# EAGLE design Schematic (EAGLE 9.5.0)
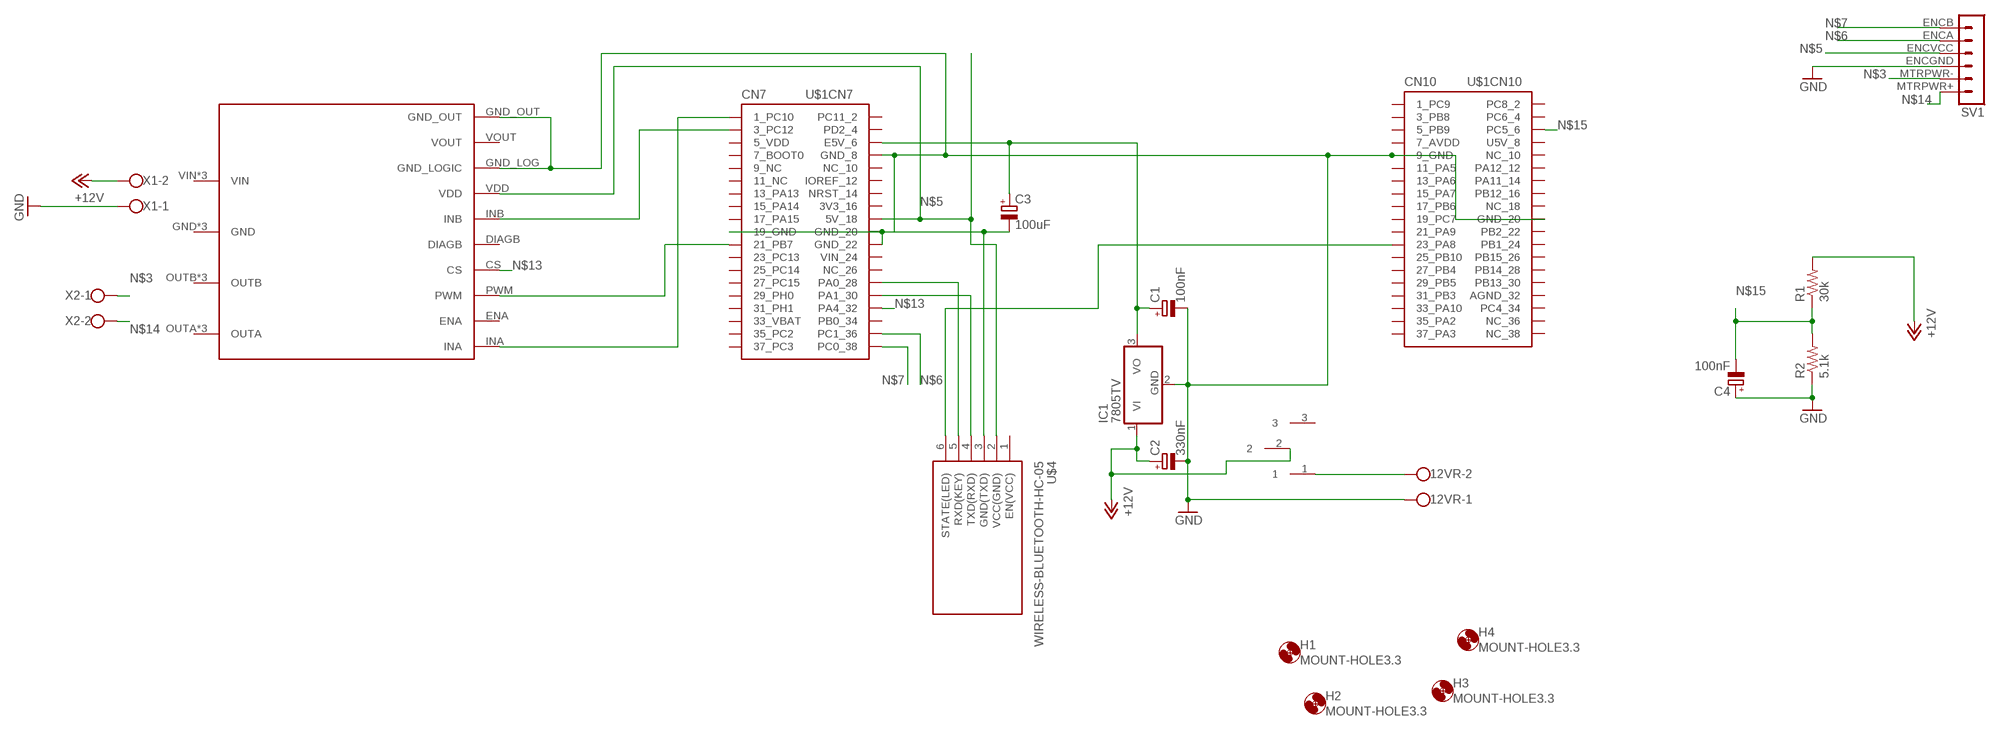
[diagram p0: schematic, sheet 1]

## Parts
12VR  W237-102  [W237-102]
C1  100nF  CPOL-EUE2.5-5  [E2,5-5]
C2  330nF  CPOL-EUE2.5-5  [E2,5-5]
C3  100uF  CPOL-EUE2.5-5  [E2,5-5]
C4  100nF  CPOL-EUE2.5-5  [E2,5-5]
H1  MOUNT-HOLE3.3  [3,3]
H2  MOUNT-HOLE3.3  [3,3]
H3  MOUNT-HOLE3.3  [3,3]
H4  MOUNT-HOLE3.3  [3,3]
IC1  7805TV  [TO220V]
R1  30k  R-US_0204/7  [0204/7]
R2  5.1k  R-US_0204/7  [0204/7]
SV1  MA06-1  [MA06-1]
U$1  NUCLEO-SHIELD-20PIN  [NUCLEO-SHIELD-UNDERSIDE-SHORT-20-PINHEADER]
U$2  VNH5019REAL  [MULTIPOWERSO-302]
U$3  TOGGLESWITCH  [TOGGLESWITCH]
U$4  WIRELESS-BLUETOOTH-HC-05  [WIRELESS-BLUETOOTH-HC-05]
X1  W237-102  [W237-102]
X2  W237-102  [W237-102]

## Nets
+12V: C2.+ IC1.1(VI) R1.2 U$3.2 X1.2
GND: 12VR.1 C1.- C2.- C3.- C4.+ IC1.2(GND) R2.1 SV1.ENCGND U$1.CN7_8(CN7:GND_8) U$1.CN7_19(CN7:19_GND) U$1.CN7_20(CN7:GND_20) U$1.CN7_22(CN7:GND_22) U$1.CN10_9(CN10:9_GND) U$1.CN10_20(CN10:GND_20) U$2.GND_LOG(GND_LOGIC) U$2.GND_OUT U$4.3(GND(TXD)) X1.1
N$1: U$1.CN7_1(CN7:1_PC10) U$2.INA
N$2: U$1.CN7_21(CN7:21_PB7) U$2.PWM
N$3: SV1.MTRPWR- X2.1
N$4: U$1.CN7_3(CN7:3_PC12) U$2.INB
N$5: SV1.ENCVCC U$1.CN7_18(CN7:5V_18) U$2.VDD U$4.2(VCC(GND))
N$6: SV1.ENCA U$1.CN7_36(CN7:PC1_36)
N$7: SV1.ENCB U$1.CN7_38(CN7:PC0_38)
N$8: 12VR.2 U$3.1
N$9: U$1.CN7_30(CN7:PA1_30) U$4.4(TXD(RXD))
N$10: C1.+ C3.+ IC1.3(VO) U$1.CN7_6(CN7:E5V_6)
N$11: U$1.CN7_28(CN7:PA0_28) U$4.5(RXD(KEY))
N$12: U$1.CN10_23(CN10:23_PA8) U$4.6(STATE(LED))
N$13: U$1.CN7_32(CN7:PA4_32) U$2.CS
N$14: SV1.MTRPWR+(MTRPWR) X2.2
N$15: C4.- R1.1 R2.2 U$1.CN10_6(CN10:PC5_6)
Unconnected: U$1.CN7_2(CN7:PC11_2) U$1.CN7_4(CN7:PD2_4) U$1.CN7_5(CN7:5_VDD) U$1.CN7_7(CN7:7_BOOT0) U$1.CN7_9(CN7:9_NC) U$1.CN7_10(CN7:NC_10) U$1.CN7_11(CN7:11_NC) U$1.CN7_12(CN7:IOREF_12) U$1.CN7_13(CN7:13_PA13) U$1.CN7_14(CN7:NRST_14) U$1.CN7_15(CN7:15_PA14) U$1.CN7_16(CN7:3V3_16) U$1.CN7_17(CN7:17_PA15) U$1.CN7_23(CN7:23_PC13) U$1.CN7_24(CN7:VIN_24) U$1.CN7_25(CN7:25_PC14) U$1.CN7_26(CN7:NC_26) U$1.CN7_27(CN7:27_PC15) U$1.CN7_29(CN7:29_PH0) U$1.CN7_31(CN7:31_PH1) U$1.CN7_33(CN7:33_VBAT) U$1.CN7_34(CN7:PB0_34) U$1.CN7_35(CN7:35_PC2) U$1.CN7_37(CN7:37_PC3) U$1.CN10_1(CN10:1_PC9) U$1.CN10_2(CN10:PC8_2) U$1.CN10_3(CN10:3_PB8) U$1.CN10_4(CN10:PC6_4) U$1.CN10_5(CN10:5_PB9) U$1.CN10_7(CN10:7_AVDD) U$1.CN10_8(CN10:U5V_8) U$1.CN10_10(CN10:NC_10) U$1.CN10_11(CN10:11_PA5) U$1.CN10_12(CN10:PA12_12) U$1.CN10_13(CN10:13_PA6) U$1.CN10_14(CN10:PA11_14) U$1.CN10_15(CN10:15_PA7) U$1.CN10_16(CN10:PB12_16) U$1.CN10_17(CN10:17_PB6) U$1.CN10_18(CN10:NC_18) U$1.CN10_19(CN10:19_PC7) U$1.CN10_21(CN10:21_PA9) U$1.CN10_22(CN10:PB2_22) U$1.CN10_24(CN10:PB1_24) U$1.CN10_25(CN10:25_PB10) U$1.CN10_26(CN10:PB15_26) U$1.CN10_27(CN10:27_PB4) U$1.CN10_28(CN10:PB14_28) U$1.CN10_29(CN10:29_PB5) U$1.CN10_30(CN10:PB13_30) U$1.CN10_31(CN10:31_PB3) U$1.CN10_32(CN10:AGND_32) U$1.CN10_33(CN10:33_PA10) U$1.CN10_34(CN10:PC4_34) U$1.CN10_35(CN10:35_PA2) U$1.CN10_36(CN10:NC_36) U$1.CN10_37(CN10:37_PA3) U$1.CN10_38(CN10:NC_38) U$2.DIAGB U$2.ENA U$2.GND U$2.GNDS1(GND) U$2.GNDS2(GND) U$2.OUTA U$2.OUTAS1(OUTA) U$2.OUTAS2(OUTA) U$2.OUTB U$2.OUTBS1(OUTB) U$2.OUTBS2(OUTB) U$2.VIN U$2.VINS1(VIN) U$2.VINS2(VIN) U$2.VOUT U$3.3

## Power pins joined to a net without a drawn wire
EN(VCC): U$4.1(EN(VCC))

## Library data of the parts
12VR X1 X2 = con-wago-500:W237-102: WAGO SCREW CLAMP; MPN: 237-102; OC_FARNELL: unknown; OC_NEWARK: 70K9898
C1-C4 = rcl:CPOL-EU: POLARIZED CAPACITOR, European symbol; SPICEPREFIX: C
H1-H4 = holes:MOUNT-HOLE: MOUNTING HOLE with drill center marker
IC1 = linear:78*: Positive VOLTAGE REGULATOR Source: http://cache.national.com/ds/LM/LM78L05.pdf http://www.fairchildsemi.com/ds/LM/LM7805.pdf
R1 R2 = rcl:R-US_: RESISTOR, American symbol; SPICEPREFIX: R
SV1 = Custom:MA06-1: PIN HEADER; OC_FARNELL: unknown; OC_NEWARK: unknown
U$1 = CN7Fixed:NUCLEO-SHIELD: Shield template for ST Nucleo boards
U$2 = Custom:VNH5019REAL
U$3 = Custom:TOGGLESWITCH
U$4 = BT_6pin:WIRELESS-BLUETOOTH-HC-05: Bluetooth Transceiver Module based on HC-05 board Tutorial is available here: https://arduino-info.wikispaces.com/BlueTooth-HC05-HC06-Modules-How-To Click here to find device on ebay.com <http://www.ebay.com/sch/hc-05+module+rs232>

## Board
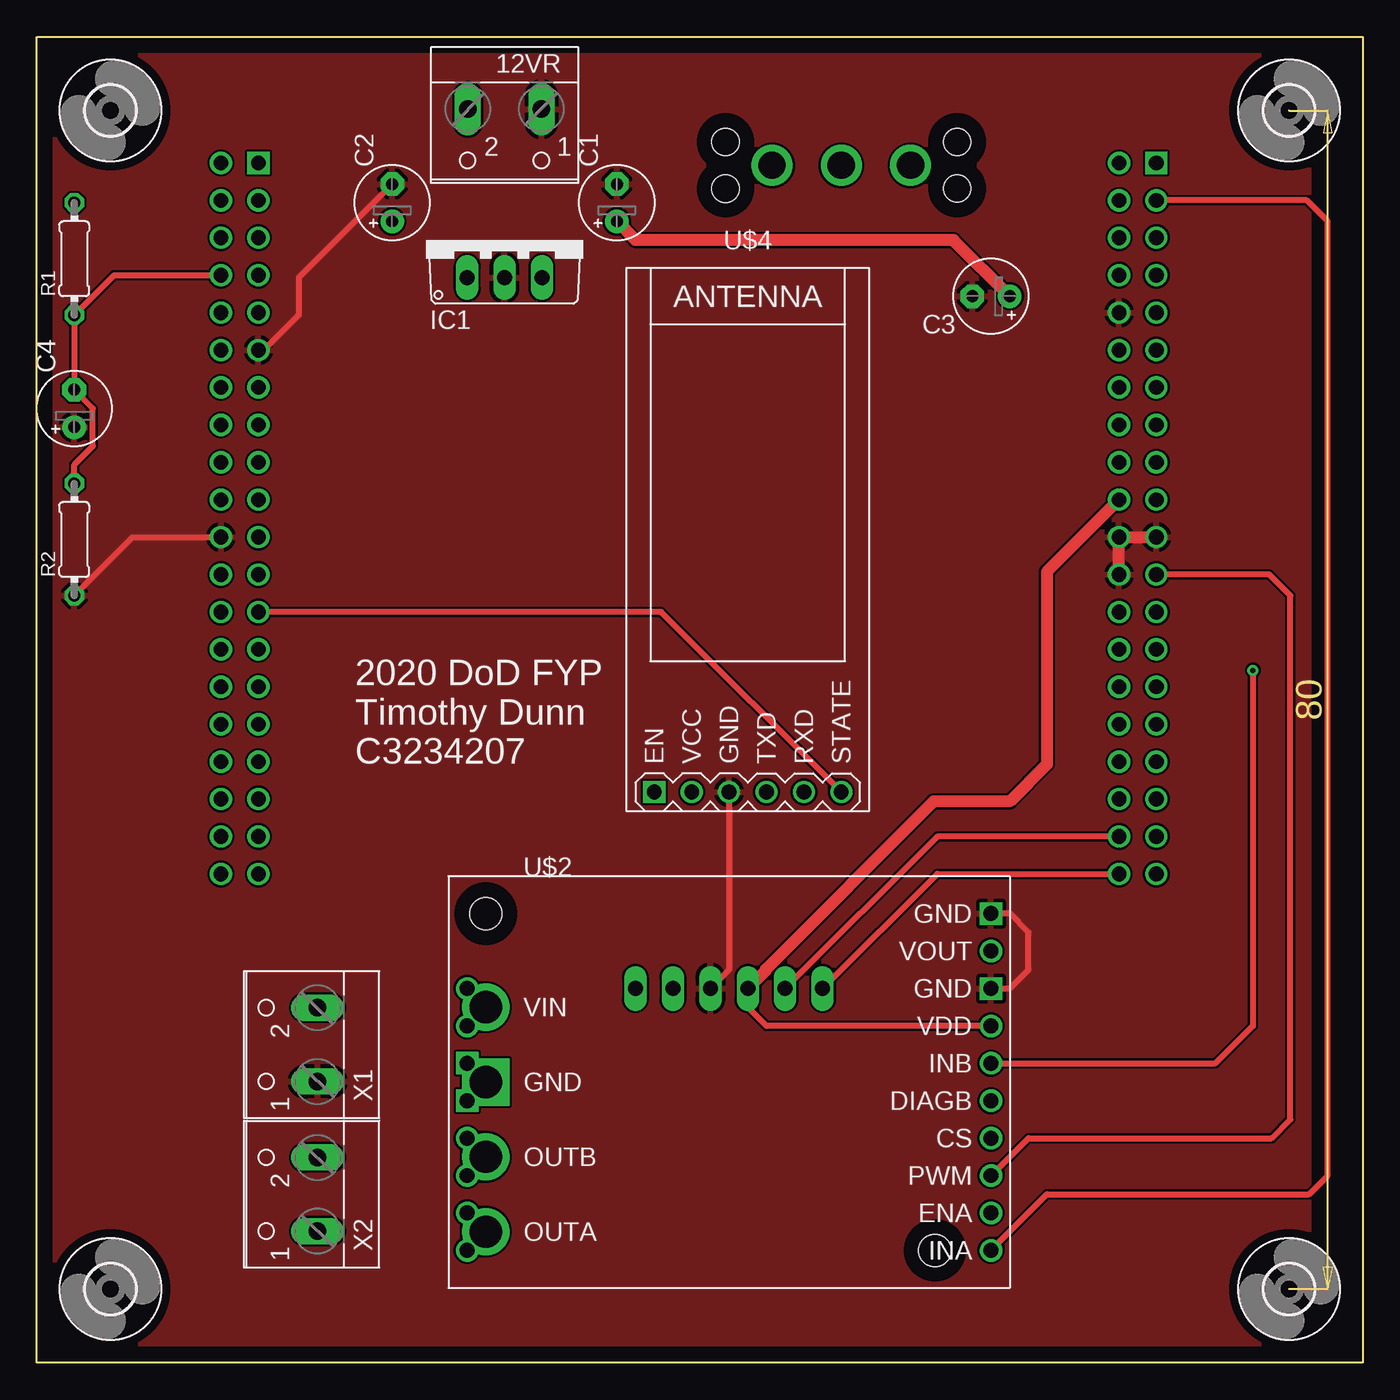
[diagram p1: board, top side]
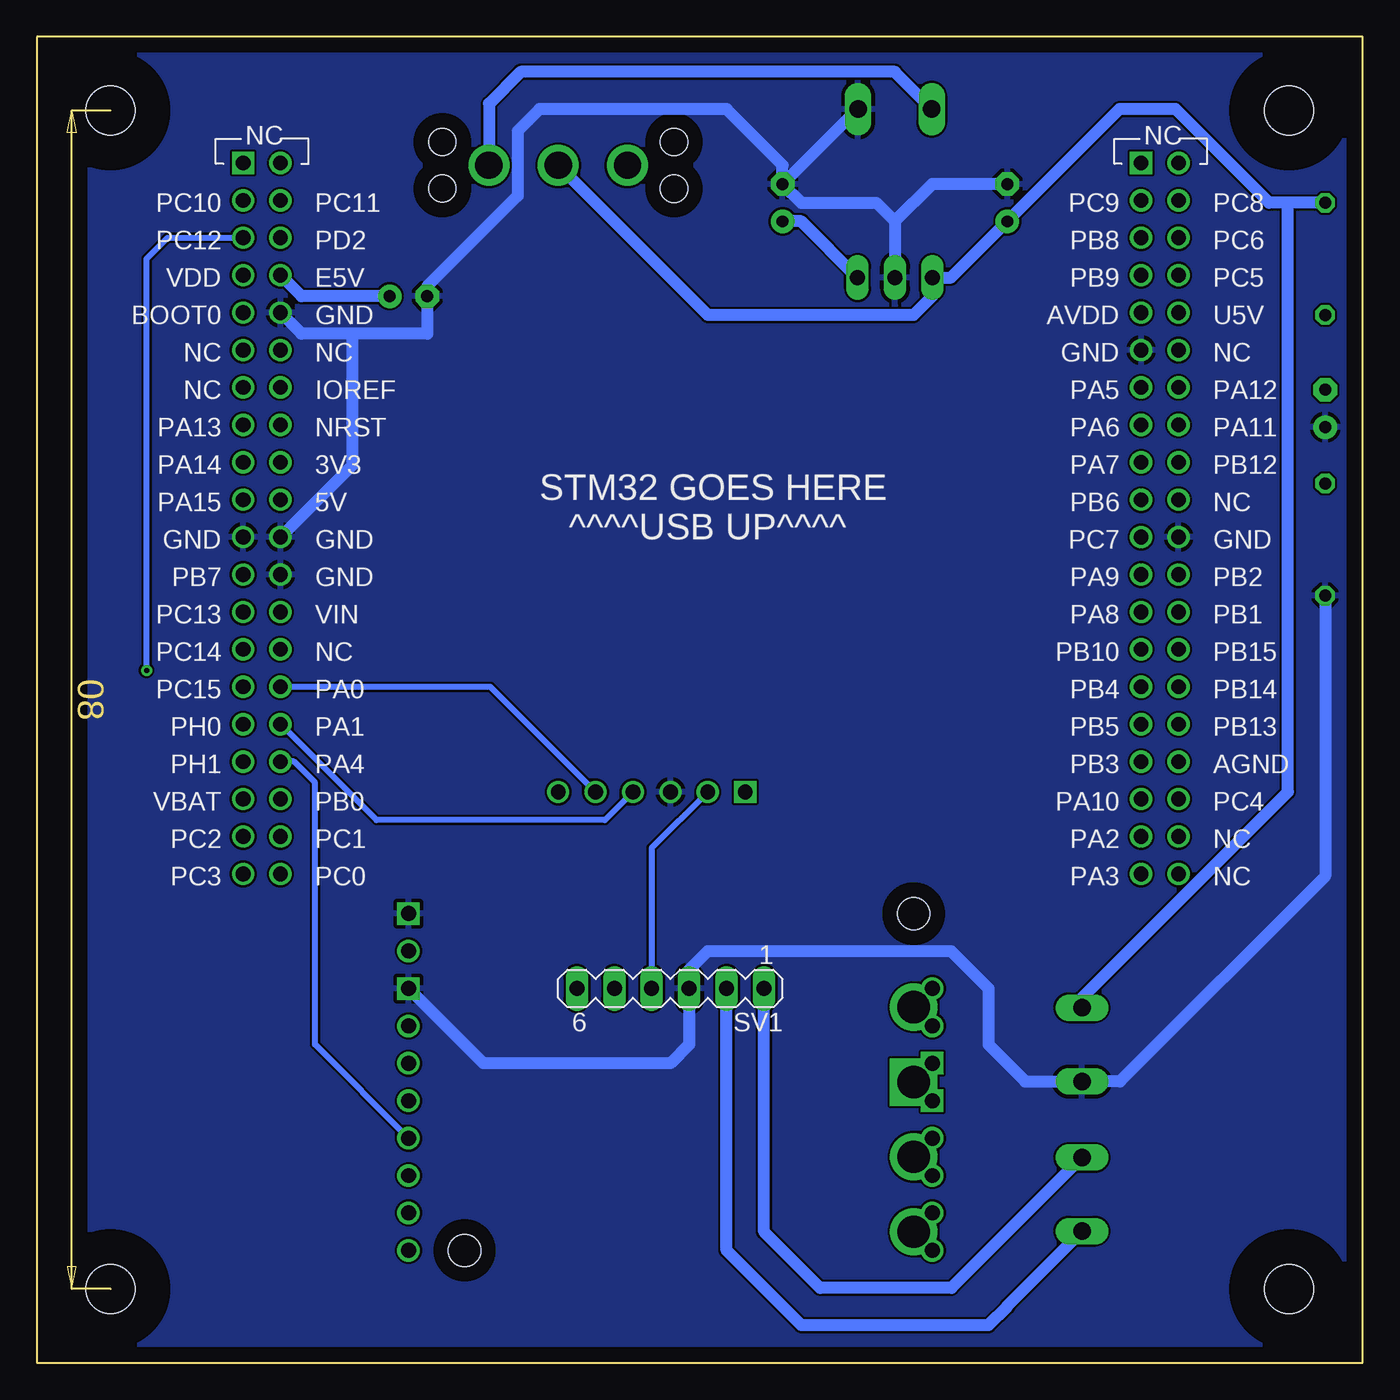
[diagram p2: board, bottom side, seen from below]

Size 90 x 90 mm. Coordinates in mm from the lower left corner, seen from the top.
Outline: 0,0 0,90 90,90 90,0 0,0
Copper layers (1*16): Top 0.035mm / dielectric 1.5mm / Bottom 0.035mm
Design rules "default": minimum track width 6mil, minimum drill 0.35mm, track to track 6mil, track to pad 6mil, pad to pad 6mil, via to via 6mil, smd to smd 6mil, copper to edge 40mil, drill to drill 6mil, minimum pad ring 10mil, minimum via ring 8mil, stop-mask expansion 4mil, vias tented up to drill 0mil, thermal gap 10mil

### Footprints (pad centres in the part's own frame; a part is rotated, then mirrored left to right if it is on the bottom)
W237-102 = drill 1.194 long: 1 -2.5,-1.27; 2 2.5,-1.27
E2,5-5 = drill 0.813 pad 1.6: + -1.27,0 | drill 0.813 pad 1.6 octagon: - 1.27,0
3,3 = hole 3.3: 0,0
TO220V = drill 1.016 long: 1 -2.54,-2.54; 2 0,-2.54; 3 2.54,-2.54
0204/7 = drill 0.813 octagon: 1 -3.81,0; 2 3.81,0
MA06-1 = drill 1.016 long: ENCA 3.81,0; ENCB 6.35,0; ENCGND -1.27,0; ENCVCC 1.27,0; MTRPWR+ -6.35,0; MTRPWR- -3.81,0
NUCLEO-SHIELD-UNDERSIDE-SHORT-20-PINHEADER = drill 1: CN7_1 -31.55,23.02; CN7_2 -29.01,23.02; CN7_3 -31.55,20.48; CN7_4 -29.01,20.48; CN7_5 -31.55,17.94; CN7_6 -29.01,17.94; CN7_7 -31.55,15.4; CN7_8 -29.01,15.4; CN7_9 -31.55,12.86; CN7_10 -29.01,12.86; CN7_11 -31.55,10.32; CN7_12 -29.01,10.32; CN7_13 -31.55,7.78; CN7_14 -29.01,7.78; CN7_15 -31.55,5.24; CN7_16 -29.01,5.24; CN7_17 -31.55,2.7; CN7_18 -29.01,2.7; CN7_19 -31.55,0.16; CN7_20 -29.01,0.16; CN7_21 -31.55,-2.38; CN7_22 -29.01,-2.38; CN7_23 -31.55,-4.92; CN7_24 -29.01,-4.92; CN7_25 -31.55,-7.46; CN7_26 -29.01,-7.46; CN7_27 -31.55,-10; CN7_28 -29.01,-10; CN7_29 -31.55,-12.54; CN7_30 -29.01,-12.54; CN7_31 -31.55,-15.08; CN7_32 -29.01,-15.08; CN7_33 -31.55,-17.62; CN7_34 -29.01,-17.62; CN7_35 -31.55,-20.16; CN7_36 -29.01,-20.16; CN7_37 -31.55,-22.7; CN7_38 -29.01,-22.7; CN7_40 -29.01,25.56; CN10_1 29.41,23.02; CN10_2 31.95,23.02; CN10_3 29.41,20.48; CN10_4 31.95,20.48; CN10_5 29.41,17.94; CN10_6 31.95,17.94; CN10_7 29.41,15.4; CN10_8 31.95,15.4; CN10_9 29.41,12.86; CN10_10 31.95,12.86; CN10_11 29.41,10.32; CN10_12 31.95,10.32; CN10_13 29.41,7.78; CN10_14 31.95,7.78; CN10_15 29.41,5.24; CN10_16 31.95,5.24; CN10_17 29.41,2.7; CN10_18 31.95,2.7; CN10_19 29.41,0.16; CN10_20 31.95,0.16; CN10_21 29.41,-2.38; CN10_22 31.95,-2.38; CN10_23 29.41,-4.92; CN10_24 31.95,-4.92; CN10_25 29.41,-7.46; CN10_26 31.95,-7.46; CN10_27 29.41,-10; CN10_28 31.95,-10; CN10_29 29.41,-12.54; CN10_30 31.95,-12.54; CN10_31 29.41,-15.08; CN10_32 31.95,-15.08; CN10_33 29.41,-17.62; CN10_34 31.95,-17.62; CN10_35 29.41,-20.16; CN10_36 31.95,-20.16; CN10_37 29.41,-22.7; CN10_38 31.95,-22.7; CN10_39 31.95,25.56 | drill 1 square: CN7_39 -31.55,25.56; CN10_40 29.41,25.56
MULTIPOWERSO-302 = drill 1.016: CS 3.81,16.51; DIAGB 1.27,16.51; ENA 8.89,16.51; INA 11.43,16.51; INB -1.27,16.51; OUTAS1 8.89,-19.05; OUTAS2 11.43,-19.05; OUTBS1 3.81,-19.05; OUTBS2 6.35,-19.05; PWM 6.35,16.51; VDD -3.81,16.51; VINS1 -6.35,-19.05; VINS2 -3.81,-19.05; VOUT -8.89,16.51 | drill 2.184 square: GND 0,-17.78 | drill 1.016 square: GND_LOG -6.35,16.51; GND_OUT -11.43,16.51; GNDS1 -1.27,-19.05; GNDS2 1.27,-19.05 | drill 2.184: OUTA 10.16,-17.78; OUTB 5.08,-17.78; VIN -5.08,-17.78 | hole 2.184: -11.43,-17.78; 11.43,12.7
TOGGLESWITCH = drill 1.85: 1 0,-4.7; 2 0,0; 3 0,4.7 | hole 1.85: 1.59,7.87; -1.59,7.87; 1.59,-7.87; -1.58,-7.87
WIRELESS-BLUETOOTH-HC-05 = drill 1 square: 1 -6.35,-17.145 | drill 1: 2 -3.81,-17.145; 3 -1.27,-17.145; 4 1.27,-17.145; 5 3.81,-17.145; 6 6.35,-17.145

### Placement (x,y rotation side)
12VR  31.75,83.82 180 top
C1  39.37,78.74 90 top
C2  24.13,78.74 90 top
C3  64.77,72.39 180 top
C4  2.54,64.77 90 top
H1  5,5 0 top
H2  85,85 0 top
H3  85,5 0 top
H4  5,85 0 top
IC1  31.75,76.2 0 top
R1  2.54,74.93 90 top
R2  2.54,55.88 90 top
SV1  46.99,25.4 180 bottom
U$1  44.45,55.88 0 bottom
U$2  48.26,19.05 270 top
U$3  54.61,81.28 90 top
U$4  48.26,55.88 0 top
X1  17.78,21.59 90 top
X2  17.78,11.43 90 top

### Tracks (layer width: path | path; a pad name or v marks a point on that pad's centre or on a via)
+12V
  Bottom 0.813: U$3.2 44.45,71.12 30.48,71.12 29.21,72.39 IC1.1 27.94,73.66 C2.+ 16.51,85.09 12.7,85.09 6.35,78.74 5.08,78.74 | R1.2 5.08,78.74 | X1.2 19.05,24.77 5.08,38.74 5.08,78.74
GND
  Top 0.406: U$2.GND_LOG 66.04,25.4 67.31,26.67 67.31,29.21 66.04,30.48 U$2.GND_OUT | R2.1 6.51,56.04 U$1.CN10_20 | C2.- 17.78,73.66 17.78,71.12 15.4,68.74 U$1.CN10_9 | U$4.3 46.99,26.67 SV1.ENCGND
  Top 0.813: U$1.CN7_22 U$1.CN7_20 U$1.CN7_19
  Bottom 0.813: 12VR.1 34.29,85.09 C1.- | C1.- 38.1,78.74 33.02,78.74 31.75,77.47 | 31.75,77.47 IC1.2 | C2.- 29.21,80.01 31.75,77.47 | C1.- 39.37,81.28 43.18,85.09 55.88,85.09 57.36,83.61 57.36,79.2 63.5,73.07 C3.- 63.5,69.85 68.58,69.85 | 68.58,69.85 72.03,69.85 U$1.CN7_8 | U$2.GND_LOG 59.69,20.32 46.99,20.32 45.72,21.59 SV1.ENCGND 45.72,26.67 44.45,27.94 27.94,27.94 25.4,25.4 25.4,21.59 22.9,19.09 X1.1 16.47,19.09 2.54,33.02 R2.1 | U$1.CN7_20 68.58,60.92 68.58,69.85
  pour Bottom (isolate 0.003): -13.97,-5.08 -13.97,93.98 -11.43,96.52 92.71,96.52 100.33,88.9 100.33,-5.08
  pour Top (isolate 0.003): -13.97,-5.08 -13.97,99.06 97.79,99.06 102.87,93.98 102.87,-8.89 -8.89,-8.89 -12.7,-5.08
N$1
  Top 0.406: U$2.INA 68.58,11.43 86.36,11.43 87.63,12.7 87.63,77.47 86.2,78.9 U$1.CN7_1
N$2
  Top 0.406: U$1.CN7_21 83.66,53.5 85.09,52.07 85.09,16.51 83.82,15.24 67.31,15.24 U$2.PWM
N$3
  Bottom 0.813: X2.1 24.13,3.85 24.13,3.81 25.4,2.54 38.1,2.54 43.18,7.62 SV1.MTRPWR-
N$4  (via drill 0.35)
  Top 0.406: U$2.INB 80.01,20.32 82.55,22.86 v82.55,46.99
  Bottom 0.406: v82.55,46.99 82.55,74.93 81.12,76.36 U$1.CN7_3
N$5
  Top 0.406: U$2.VDD 49.53,22.86 48.26,24.13 SV1.ENCVCC
  Top 0.813: U$1.CN7_18 68.58,53.7 68.58,40.64 66.04,38.1 60.87,38.1 49.48,26.71 49.48,26.62 SV1.ENCVCC
  Bottom 0.406: U$4.2 48.26,34.92 SV1.ENCVCC
N$6
  Top 0.406: U$1.CN7_36 61.12,35.72 SV1.ENCA
N$7
  Top 0.406: SV1.ENCB 61.12,33.18 U$1.CN7_38
N$8
  Bottom 0.813: 12VR.2 31.75,87.59 31.75,87.63 57.15,87.63 59.31,85.47 U$3.1
N$9
  Bottom 0.406: U$4.4 51.44,36.83 66.95,36.83 U$1.CN7_30
N$10
  Top 0.813: C1.+ 40.64,76.2 62.23,76.2 C3.+
  Bottom 0.813: IC1.3 38.1,77.47 C1.+ | C3.+ 72.03,72.39 U$1.CN7_6
N$11
  Bottom 0.406: U$4.5 59.22,45.88 U$1.CN7_28
N$12
  Top 0.406: U$4.6 42.38,50.96 U$1.CN10_23
N$13
  Bottom 0.406: U$2.CS 71.12,21.59 71.12,39.37 72.55,40.8 U$1.CN7_32
N$14
  Bottom 0.813: X2.2 27.9,5.08 36.83,5.08 40.64,8.89 SV1.MTRPWR+
N$15
  Top 0.406: R2.2 2.54,60.96 3.81,62.23 3.81,64.77 C4.- R1.1 5.24,73.82 U$1.CN10_6

### Text on the board
tPlace: 2020 DoD FYP / Timothy Dunn / C3234207
bPlace: STM32 GOES HERE / ^^^^USB UP^^^^